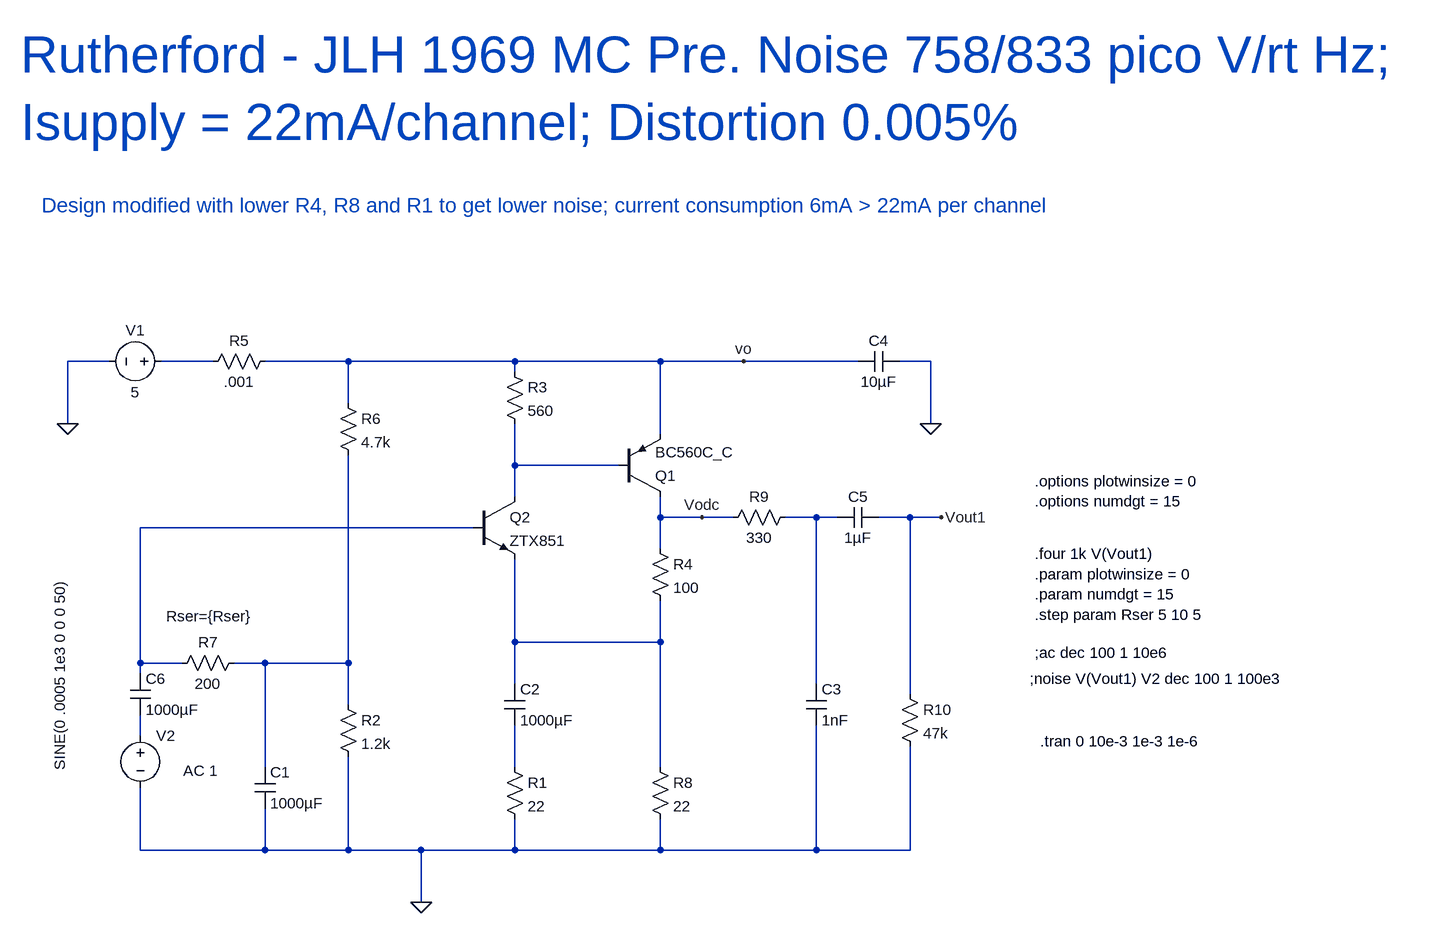
[diagram p0: schematic Rutherford.asc]
Rutherford.asc, the LTspice schematic file:
Version 4
SHEET 1 3088 680
WIRE -16 -384 -80 -384
WIRE 144 -384 64 -384
WIRE 352 -384 224 -384
WIRE 608 -384 352 -384
WIRE 832 -384 608 -384
WIRE 960 -384 832 -384
WIRE 1136 -384 960 -384
WIRE 1248 -384 1200 -384
WIRE 608 -368 608 -384
WIRE 352 -320 352 -384
WIRE -80 -288 -80 -384
WIRE 1248 -288 1248 -384
WIRE 832 -272 832 -384
WIRE 608 -224 608 -288
WIRE 768 -224 608 -224
WIRE 608 -176 608 -224
WIRE 832 -144 832 -176
WIRE 896 -144 832 -144
WIRE 944 -144 896 -144
WIRE 1072 -144 1024 -144
WIRE 1104 -144 1072 -144
WIRE 1216 -144 1168 -144
WIRE 1264 -144 1216 -144
WIRE 544 -128 32 -128
WIRE 832 -96 832 -144
WIRE 608 48 608 -80
WIRE 832 48 832 -16
WIRE 832 48 608 48
WIRE 32 80 32 -128
WIRE 96 80 32 80
WIRE 224 80 176 80
WIRE 352 80 352 -240
WIRE 352 80 224 80
WIRE 32 96 32 80
WIRE 608 112 608 48
WIRE 1072 112 1072 -144
WIRE 1216 128 1216 -144
WIRE 352 144 352 80
WIRE 32 192 32 160
WIRE 224 240 224 80
WIRE 608 240 608 176
WIRE 832 240 832 48
WIRE 32 368 32 272
WIRE 224 368 224 304
WIRE 224 368 32 368
WIRE 352 368 352 224
WIRE 352 368 224 368
WIRE 464 368 352 368
WIRE 608 368 608 320
WIRE 608 368 464 368
WIRE 832 368 832 320
WIRE 832 368 608 368
WIRE 1072 368 1072 176
WIRE 1072 368 832 368
WIRE 1216 368 1216 208
WIRE 1216 368 1072 368
WIRE 464 448 464 368
FLAG 464 448 0
FLAG -80 -288 0
FLAG 1248 -288 0
FLAG 1264 -144 Vout1
FLAG 896 -144 Vodc
FLAG 960 -384 vo
SYMBOL res 592 224 R0
SYMATTR InstName R1
SYMATTR Value 22
SYMBOL res 592 -384 R0
SYMATTR InstName R3
SYMATTR Value 560
SYMBOL voltage 80 -384 R90
WINDOW 0 -32 56 VBottom 2
WINDOW 3 32 56 VTop 2
WINDOW 123 2 56 VBottom 2
WINDOW 39 0 0 Left 2
SYMATTR InstName V1
SYMATTR Value 5
SYMBOL voltage 32 176 R0
WINDOW 3 -124 -226 VRight 2
WINDOW 123 66 70 Left 2
WINDOW 39 40 -168 Left 2
SYMATTR Value SINE(0 .0005 1e3 0 0 0 50)
SYMATTR Value2 AC 1
SYMATTR SpiceLine Rser={Rser}
SYMATTR InstName V2
SYMBOL cap 1200 -400 R90
WINDOW 0 0 32 VBottom 2
WINDOW 3 32 32 VTop 2
SYMATTR InstName C4
SYMATTR Value 10µF
SYMBOL pnp 768 -176 M180
SYMATTR InstName Q1
SYMATTR Value BC560C_C
SYMBOL res 336 128 R0
SYMATTR InstName R2
SYMATTR Value 1.2k
SYMBOL res 816 -112 R0
SYMATTR InstName R4
SYMATTR Value 100
SYMBOL res 1200 112 R0
SYMATTR InstName R10
SYMATTR Value 47k
SYMBOL res 240 -400 R90
WINDOW 0 0 56 VBottom 2
WINDOW 3 32 56 VTop 2
SYMATTR InstName R5
SYMATTR Value .001
SYMBOL npn 544 -176 R0
SYMATTR InstName Q2
SYMATTR Value ZTX851
SYMBOL res 336 -336 R0
SYMATTR InstName R6
SYMATTR Value 4.7k
SYMBOL res 192 64 R90
WINDOW 0 0 56 VBottom 2
WINDOW 3 32 56 VTop 2
SYMATTR InstName R7
SYMATTR Value 200
SYMBOL cap 208 240 R0
SYMATTR InstName C1
SYMATTR Value 1000µF
SYMBOL res 816 224 R0
SYMATTR InstName R8
SYMATTR Value 22
SYMBOL cap 592 112 R0
SYMATTR InstName C2
SYMATTR Value 1000µF
SYMBOL res 1040 -160 R90
WINDOW 0 0 56 VBottom 2
WINDOW 3 32 56 VTop 2
SYMATTR InstName R9
SYMATTR Value 330
SYMBOL cap 1056 112 R0
SYMATTR InstName C3
SYMATTR Value 1nF
SYMBOL cap 1168 -160 R90
WINDOW 0 0 32 VBottom 2
WINDOW 3 32 32 VTop 2
SYMATTR InstName C5
SYMATTR Value 1µF
SYMBOL cap 16 96 R0
SYMATTR InstName C6
SYMATTR Value 1000µF
TEXT 1408 64 Left 2 !;ac dec 100 1 10e6
TEXT 1416 200 Left 2 !.tran 0 10e-3 1e-3 1e-6
TEXT 1400 104 Left 2 !;noise V(Vout1) V2 dec 100 1 100e3
TEXT 1408 -88 Left 2 !.four 1k V(Vout1)\n.param plotwinsize = 0\n.param numdgt = 15\n.step param Rser 5 10 5
TEXT 1408 -200 Left 2 !.options plotwinsize = 0\n.options numdgt = 15
TEXT -152 -856 Left 6 ;Rutherford - JLH 1969 MC Pre. Noise 758/833 pico V/rt Hz; \nIsupply = 22mA/channel; Distortion 0.005%
TEXT -120 -624 Left 3 ;Design modified with lower R4, R8 and R1 to get lower noise; current consumption 6mA > 22mA per channel

The netlist it stands for:
* Rutherford.asc
R1 N008 0 22
R3 vo N002 560
V1 N001 0 5
V2 N007 0 SINE(0 .0005 1e3 0 0 0 50) AC 1 Rser={Rser}
C4 0 vo 10µF
Q1 Vodc N002 vo 0 BC560C_C
R2 N006 0 1.2k
R4 Vodc N005 100
R10 Vout1 0 47k
R5 vo N001 .001
Q2 N002 N004 N005 0 ZTX851
R6 vo N006 4.7k
R7 N006 N004 200
C1 N006 0 1000µF
R8 N005 0 22
C2 N005 N008 1000µF
R9 N003 Vodc 330
C3 N003 0 1nF
C5 Vout1 N003 1µF
C6 N004 N007 1000µF
.model NPN NPN
.model PNP PNP
.lib standard.bjt
;ac dec 100 1 10e6
.tran 0 10e-3 1e-3 1e-6
;noise V(Vout1) V2 dec 100 1 100e3
.four 1k V(Vout1)
.param plotwinsize = 0
.param numdgt = 15
.step param Rser 5 10 5
.options plotwinsize = 0
.options numdgt = 15
* Rutherford - JLH 1969 MC Pre. Noise 758/833 pico V/rt Hz;
* Isupply = 22mA/channel; Distortion 0.005%
* Design modified with lower R4, R8 and R1 to get lower noise; current consumption 6mA > 22mA per channel
.backanno
.end